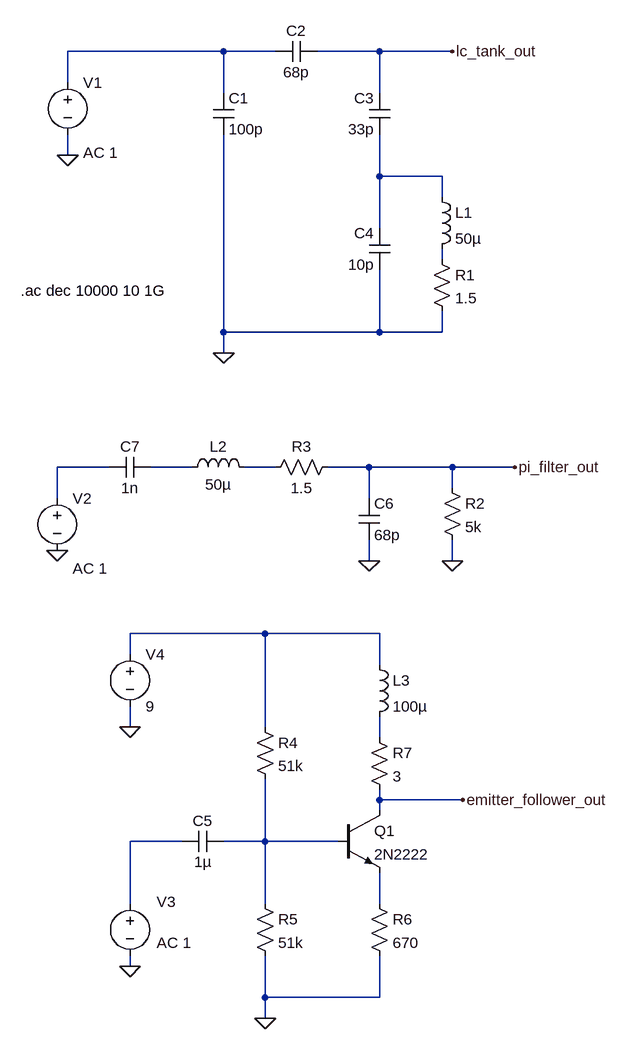
[diagram p0: schematic 1MHz_oscillator.asc]
1MHz_oscillator.asc, the LTspice schematic file:
Version 4
SHEET 1 880 1540
WIRE 16 32 -224 32
WIRE 96 32 16 32
WIRE 256 32 160 32
WIRE 368 32 256 32
WIRE -224 80 -224 32
WIRE 16 96 16 32
WIRE 256 96 256 32
WIRE -224 192 -224 160
WIRE 256 224 256 160
WIRE 352 224 256 224
WIRE 352 256 352 224
WIRE 256 304 256 224
WIRE 352 352 352 336
WIRE 16 464 16 160
WIRE 256 464 256 368
WIRE 256 464 16 464
WIRE 352 464 352 432
WIRE 352 464 256 464
WIRE 16 496 16 464
WIRE -160 672 -240 672
WIRE -32 672 -96 672
WIRE 96 672 48 672
WIRE 240 672 176 672
WIRE 368 672 240 672
WIRE 464 672 368 672
WIRE 368 704 368 672
WIRE -240 720 -240 672
WIRE 240 720 240 672
WIRE 240 816 240 784
WIRE 368 816 368 784
WIRE 80 928 -128 928
WIRE 256 928 80 928
WIRE -128 960 -128 928
WIRE 256 976 256 928
WIRE -128 1072 -128 1040
WIRE 80 1072 80 928
WIRE 256 1088 256 1056
WIRE 256 1184 256 1168
WIRE 384 1184 256 1184
WIRE 256 1200 256 1184
WIRE -48 1248 -128 1248
WIRE 80 1248 80 1152
WIRE 80 1248 16 1248
WIRE 192 1248 80 1248
WIRE -128 1344 -128 1248
WIRE 80 1344 80 1248
WIRE 256 1344 256 1296
WIRE -128 1440 -128 1424
WIRE 80 1488 80 1424
WIRE 256 1488 256 1424
WIRE 256 1488 80 1488
WIRE 80 1520 80 1488
FLAG -224 192 0
FLAG 16 496 0
FLAG 240 816 0
FLAG -240 800 0
FLAG 368 32 lc_tank_out
FLAG 464 672 pi_filter_out
FLAG 368 816 0
FLAG 384 1184 emitter_follower_out
FLAG -128 1440 0
FLAG -128 1072 0
FLAG 80 1520 0
SYMBOL cap 0 96 R0
SYMATTR InstName C1
SYMATTR Value 100p
SYMBOL cap 160 16 R90
WINDOW 0 0 32 VBottom 2
WINDOW 3 32 32 VTop 2
SYMATTR InstName C2
SYMATTR Value 68p
SYMBOL cap 272 160 R180
WINDOW 0 24 56 Left 2
WINDOW 3 24 8 Left 2
SYMATTR InstName C3
SYMATTR Value 33p
SYMBOL cap 272 368 R180
WINDOW 0 24 56 Left 2
WINDOW 3 24 8 Left 2
SYMATTR InstName C4
SYMATTR Value 10p
SYMBOL ind 336 240 R0
SYMATTR InstName L1
SYMATTR Value 50µ
SYMBOL voltage -224 64 R0
WINDOW 123 24 124 Left 2
WINDOW 39 0 0 Left 0
SYMATTR Value2 AC 1
SYMATTR InstName V1
SYMATTR Value ""
SYMBOL res 336 336 R0
SYMATTR InstName R1
SYMATTR Value 1.5
SYMBOL cap 224 720 R0
SYMATTR InstName C6
SYMATTR Value 68p
SYMBOL ind -48 688 R270
WINDOW 0 32 56 VTop 2
WINDOW 3 5 56 VBottom 2
SYMATTR InstName L2
SYMATTR Value 50µ
SYMBOL cap -96 656 R90
WINDOW 0 0 32 VBottom 2
WINDOW 3 32 32 VTop 2
SYMATTR InstName C7
SYMATTR Value 1n
SYMBOL voltage -240 704 R0
WINDOW 123 24 124 Left 2
WINDOW 39 0 0 Left 0
SYMATTR Value2 AC 1
SYMATTR InstName V2
SYMATTR Value ""
SYMBOL res 192 656 R90
WINDOW 0 0 56 VBottom 2
WINDOW 3 32 56 VTop 2
SYMATTR InstName R3
SYMATTR Value 1.5
SYMBOL res 352 688 R0
SYMATTR InstName R2
SYMATTR Value 5k
SYMBOL npn 192 1200 R0
SYMATTR InstName Q1
SYMATTR Value 2N2222
SYMBOL res 64 1056 R0
SYMATTR InstName R4
SYMATTR Value 51k
SYMBOL res 64 1328 R0
SYMATTR InstName R5
SYMATTR Value 51k
SYMBOL cap 16 1232 R90
WINDOW 0 0 32 VBottom 2
WINDOW 3 32 32 VTop 2
SYMATTR InstName C5
SYMATTR Value 1µ
SYMBOL res 240 1328 R0
SYMATTR InstName R6
SYMATTR Value 670
SYMBOL ind 240 960 R0
SYMATTR InstName L3
SYMATTR Value 100µ
SYMBOL res 240 1072 R0
SYMATTR InstName R7
SYMATTR Value 3
SYMBOL voltage -128 1328 R0
WINDOW 123 41 76 Left 2
WINDOW 39 0 0 Left 0
WINDOW 0 41 13 Left 2
SYMATTR Value2 AC 1
SYMATTR InstName V3
SYMATTR Value ""
SYMBOL voltage -128 944 R0
WINDOW 123 0 0 Left 0
WINDOW 39 0 0 Left 0
SYMATTR InstName V4
SYMATTR Value 9
TEXT -296 400 Left 2 !.ac dec 10000 10 1G

The netlist it stands for:
* 1MHz_oscillator.asc
C1 N001 0 100p
C2 lc_tank_out N001 68p
C3 N002 lc_tank_out 33p
C4 0 N002 10p
L1 N002 N003 50µ
V1 N001 0 AC 1
R1 N003 0 1.5
C6 pi_filter_out 0 68p
L2 N005 N006 50µ
C7 N005 N004 1n
V2 N004 0 AC 1
R3 pi_filter_out N006 1.5
R2 pi_filter_out 0 5k
Q1 emitter_follower_out N010 N011 0 2N2222
R4 N007 N010 51k
R5 N010 0 51k
C5 N010 N009 1µ
R6 N011 0 670
L3 N007 N008 100µ
R7 N008 emitter_follower_out 3
V3 N009 0 AC 1
V4 N007 0 9
.model NPN NPN
.model PNP PNP
.lib standard.bjt
.ac dec 10000 10 1G
.backanno
.end